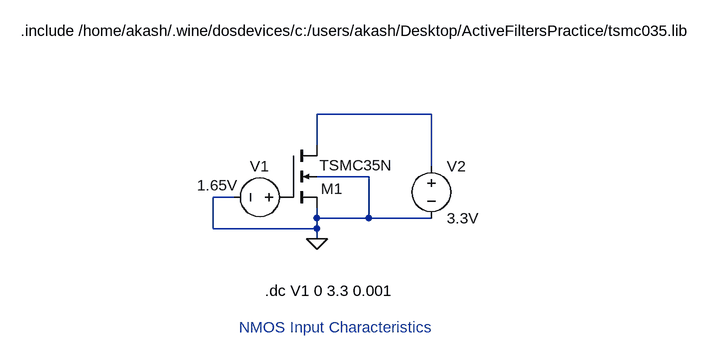
[diagram p0: schematic NMOS_Input_Characteristics.asc]
NMOS_Input_Characteristics.asc, the LTspice schematic file:
Version 4
SHEET 1 880 680
WIRE 0 80 -176 80
WIRE -176 128 -176 80
WIRE 0 160 0 80
WIRE -96 176 -176 176
WIRE -304 208 -336 208
WIRE -176 240 -176 224
WIRE -96 240 -96 176
WIRE -96 240 -176 240
WIRE 0 240 -96 240
WIRE -336 256 -336 208
WIRE -176 256 -176 240
WIRE -176 256 -336 256
WIRE -176 272 -176 256
FLAG -176 272 0
SYMBOL nmos4 -224 128 R0
WINDOW 0 54 67 Left 2
WINDOW 3 52 31 Left 2
SYMATTR InstName M1
SYMATTR Value TSMC35N
SYMATTR Value2 l=0.5u w=5u
SYMBOL voltage -208 208 R90
WINDOW 0 -32 56 VBottom 2
WINDOW 3 -34 121 VTop 2
SYMATTR InstName V1
SYMATTR Value 1.65V
SYMBOL voltage 0 144 R0
WINDOW 123 0 0 Left 0
WINDOW 39 0 0 Left 0
SYMATTR InstName V2
SYMATTR Value 3.3V
TEXT -632 -48 Left 2 !.include /home/akash/.wine/dosdevices/c:/users/akash/Desktop/ActiveFiltersPractice/tsmc035.lib
TEXT -256 352 Left 2 !.dc V1 0 3.3 0.001
TEXT -296 408 Left 2 ;NMOS Input Characteristics

The netlist it stands for:
* NMOS_Input_Characteristics.asc
M1 N001 P001 0 0 TSMC35N l=0.5u w=5u
V1 P001 0 1.65V
V2 N001 0 3.3V
.model NMOS NMOS
.model PMOS PMOS
.lib standard.mos
.include /home/akash/.wine/dosdevices/c:/users/akash/Desktop/ActiveFiltersPractice/tsmc035.lib
.dc V1 0 3.3 0.001
* NMOS Input Characteristics
.backanno
.end

* Results of the author's LTspice run, read from the files saved beside the schematic
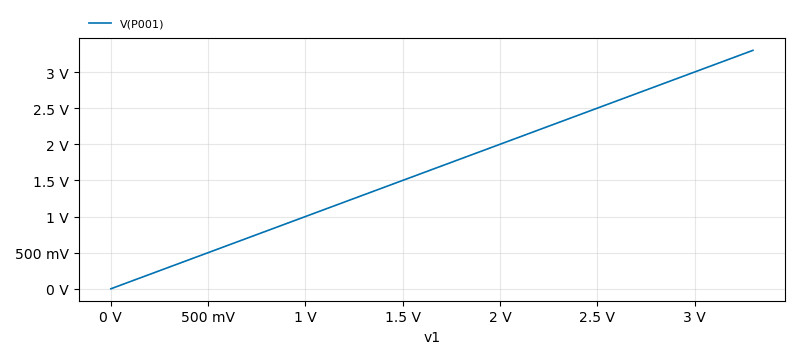
[diagram p1: DC transfer characteristic of NMOS_Input_Characteristics.asc, plotted from the saved traces]
* DC transfer characteristic, 1 run:
*   V(P001): 0 V at v1=0 V, 3.3 V at v1=3.3 V, min 0 V, max 3.3 V